# Altium schematic sheet drv.SchDoc
size A4
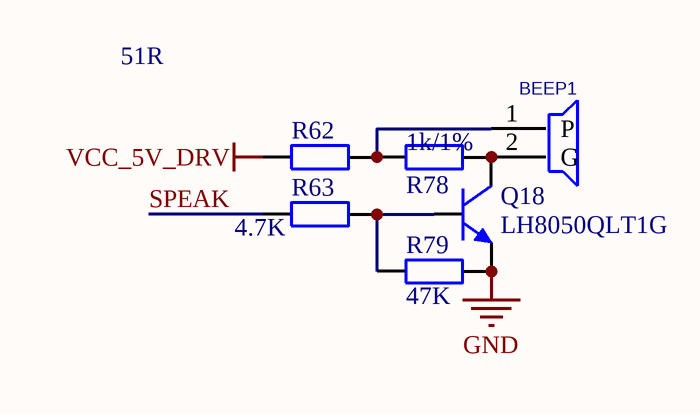
[diagram p0: drv.SchDoc]

## Parts
BEEP1  BEEP-9.5X5.5  [BEEP-9.5X5.5]  (value not drawn)  (no BOM)
Q18  LH8050QLT1G  [SOT-23]
R62  51R  [0603R]
R63  4.7K  [0603R]
R78  1k/1%  [0603R]
R79  47K  [0603R]

## Nets
GND: Q18.2(E) R79.2
VCC_5V_DRV: R62.2
SPEAK: R63.1
NetBEEP1_1: BEEP1.1(P) R62.1 R78.2
NetBEEP1_2: BEEP1.2(G) Q18.3(C) R78.1
NetQ18_1: Q18.1(B) R63.2 R79.1

## Library data of the parts
Q18 = NPN-1: NPN
R62 R63 R78 R79 = RES0: 贴片电阻 5%
BEEP1 = BEEP-9.5X5.5: PCB DECAL: BEEP-9.5X5.5